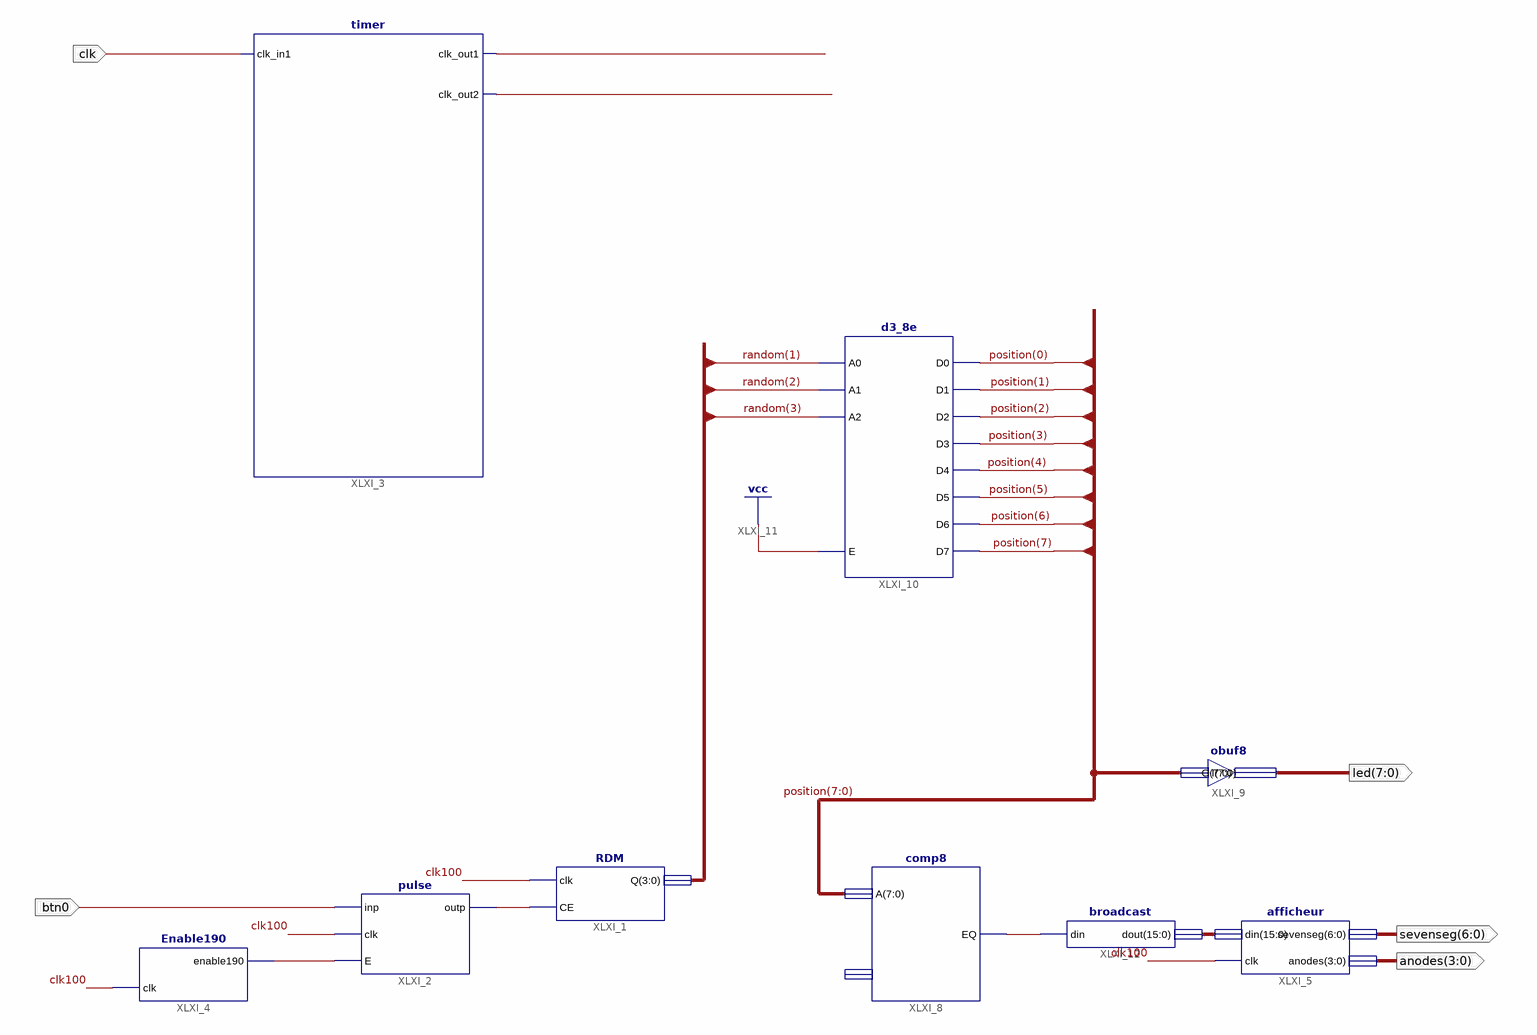
[diagram p0: schematic sheet 1]
// Xilinx ISE schematic toplevel.sch (spartan6) as structural Verilog: 9 symbols, 5 ports
module toplevel (
  input  clk,
  input  btn0,
  output [6:0] sevenseg,
  output [3:0] anodes,
  output [7:0] led
);

  wire clk3, clk100, E190, XLXN_9, XLXN_19;
  wire [3:0] random;
  wire [7:0] position;
  wire [15:0] XLXN_37;

  RDM XLXI_1 (.clk(clk100), .CE(XLXN_9), .Q(random));
  pulse XLXI_2 (.inp(btn0), .clk(clk100), .E(E190), .outp(XLXN_9));
  timer XLXI_3 (.clk_in1(clk), .clk_out1(clk100), .clk_out2(clk3));
  Enable190 XLXI_4 (.clk(clk100), .enable190(E190));
  afficheur XLXI_5 (.din(XLXN_37), .clk(clk100), .sevenseg(sevenseg), .anodes(anodes));
  comp8 XLXI_8 (.A(position), .EQ(XLXN_19));  // open: B
  obuf8 XLXI_9 (.I(position), .O(led));
  d3_8e XLXI_10 (
    .A0(random[1]), .A1(random[2]), .A2(random[3]), .E(1'b1), .D0(position[0]), .D1(position[1]),
    .D2(position[2]), .D3(position[3]), .D4(position[4]), .D5(position[5]), .D6(position[6]), .D7(position[7]));
  broadcast XLXI_12 (.din(XLXN_19), .dout(XLXN_37));
endmodule
